# Altium schematic sheet Power_TimerEvents.SchDoc
size A
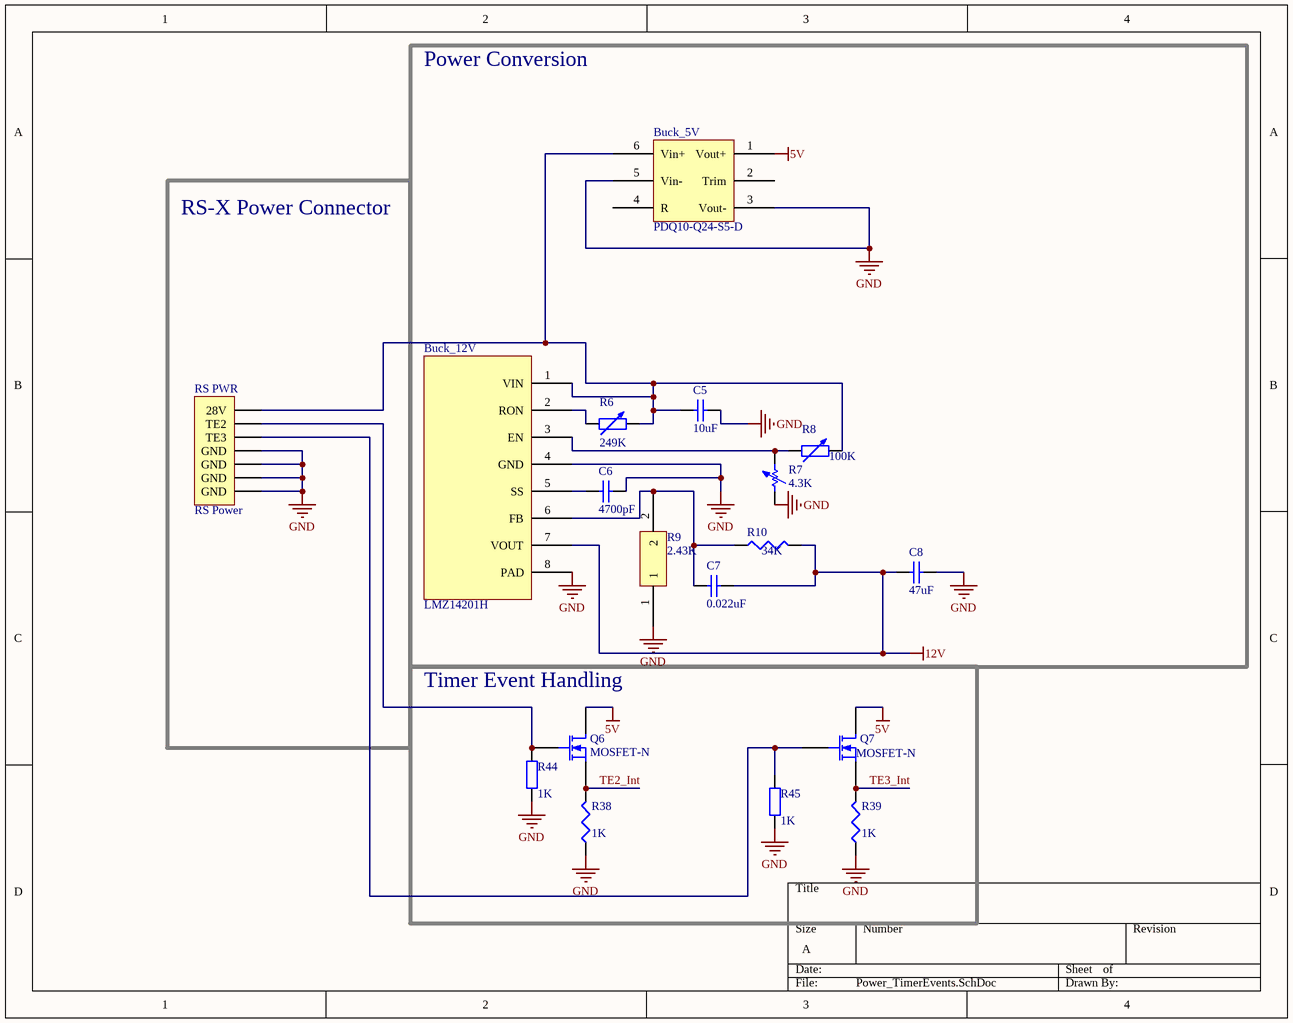
[diagram p0: Power_TimerEvents.SchDoc]

## Parts
Buck_5V  PDQ10-Q24-S5-D  [buck_5V]
Buck_12V  LMZ14201H  [LMZ1420]
C5  10uF  [C1206]
C6  4700pF  [1608[0603]]
C7  0.022uF  [1608[0603]]
C8  47uF  [C1206]
Q6  MOSFET-N  [E3]
Q7  MOSFET-N  [E3]
R6  249K  [AXIAL-0.6]
R7  4.3K  [AXIAL-0.7]
R8  100K  [AXIAL-0.6]
R9  2.43K  [smd_R9]
R10  34K  [12Z-2010]
R38  1K  [J1-0603]
R39  1K  [J1-0603]
R44  1K  [AXIAL-0.4]
R45  1K  [AXIAL-0.4]
RS_PWR  RS Power  [HDR1X7]

## Blocks framed on the sheet
Power Conversion: Buck_5V Buck_12V C5-C8 R6-R10
RS-X Power Connector: RS_PWR
Timer Event Handling: Q6 Q7 R38 R39 R44 R45

## Nets
5V: Buck_5V.1(Vout+) Q6.1(D) Q7.1(D)
12V: Buck_12V.7(VOUT) C7.2 C8.1 R10.2
GND: Buck_5V.3(Vout-) Buck_5V.5(Vin-) Buck_12V.4(GND) Buck_12V.8(PAD) C5.2 C6.2 C8.2 R7.1 R9.1 R38.1 R39.1 R44.1 R45.1 RS_PWR.4(GND) RS_PWR.5(GND) RS_PWR.6(GND) RS_PWR.7(GND)
TE2_Int: Q6.3(S) R38.2
TE3_Int: Q7.3(S) R39.2
NetBuck_5V_6: Buck_5V.6(Vin+) Buck_12V.1(VIN) C5.1 R6.2 R8.2 RS_PWR.1(28V)
NetBuck_12V_2: Buck_12V.2(RON) R6.1
NetBuck_12V_3: Buck_12V.3(EN) R7.2 R8.1
NetBuck_12V_5: Buck_12V.5(SS) C6.1
NetBuck_12V_6: Buck_12V.6(FB) C7.1 R9.2 R10.1
NetQ6_2: Q6.2(G) R44.2 RS_PWR.2(TE2)
NetQ7_2: Q7.2(G) R45.2 RS_PWR.3(TE3)

Not connected (* = marked no-connect by the designer): Buck_5V 2(Trim) 4(R)

## Library data of the parts
Buck_5V = buck_5V
Buck_12V = Component_1
C5-C8 = Cap Semi: Capacitor (Semiconductor SIM Model); Published: 8-Jun-2000; LatestRevisionDate: 29-May-2009; LatestRevisionNote: IPC-7351 Footprint Added.; PackageReference: C1206; Publisher: Altium Limited; PackageDescription: Chip Capacitor
  C5: Value: 10uF
  C6: Value: 4700pF
  C7: Value: 0.022uF
  C8: Value: 47uF
Q6 Q7 = MOSFET-N: N-Channel MOSFET; Published: 8-Jun-2000; LatestRevisionDate: 17-Jul-2002; LatestRevisionNote: Re-released for DXP Platform.; PackageVersion: 1995/1996; PackageReference: E3; Publisher: Altium Limited; PackageDescription: TO, Flat Index; 3 In-Line, Axial Leads; Body Dia. 4.6mm; Lead Dia. 0.5 mm (max)
R6 R8 = Res Adj2: Variable Resistor; Set Position: 0.5; Published: 8-Jun-2000; LatestRevisionDate: 17-Jul-2002; LatestRevisionNote: Re-released for DXP Platform.; PackageReference: AXIAL-0.6; Publisher: Altium Limited; PackageDescription: Axial Device, Thru-Hole; 2 Leads; 0.6 in Pin Spacing
  R6: Value: 249K
  R8: Value: 100K
R7 = Res Adj1: Variable Resistor; Set Position: 0.5; Published: 8-Jun-2000; LatestRevisionDate: 17-Jul-2002; LatestRevisionNote: Re-released for DXP Platform.; PackageReference: AXIAL-0.7; Publisher: Altium Limited; PackageDescription: Axial Device, Thru-Hole; 2 Leads; 0.7 in Pin Spacing; Value: 4.3K
R9 = smd_R9
R10 R38 R39 = Res3: Resistor; Published: 8-Jun-2000; LatestRevisionDate: 29-May-2009; LatestRevisionNote: IPC-7351 Footprint Added.; PackageReference: J1-0603; Publisher: Altium Limited; PackageDescription: Chip Resistor
  R10: Value: 34K
  R38 R39: Value: 1K
R44 R45 = Res2: Resistor; Published: 8-Jun-2000; LatestRevisionDate: 17-Jul-2002; LatestRevisionNote: Re-released for DXP Platform.; PackageReference: AXIAL-0.4; Publisher: Altium Limited; PackageDescription: Axial Device, Thru-Hole; 2 Leads; 0.4 in Pin Spacing; Value: 1K
RS_PWR = Header 7: Header, 7-Pin; LatestRevisionDate: 17-Jul-2002; LatestRevisionNote: Re-released for DXP Platform.; Publisher: Altium Limited